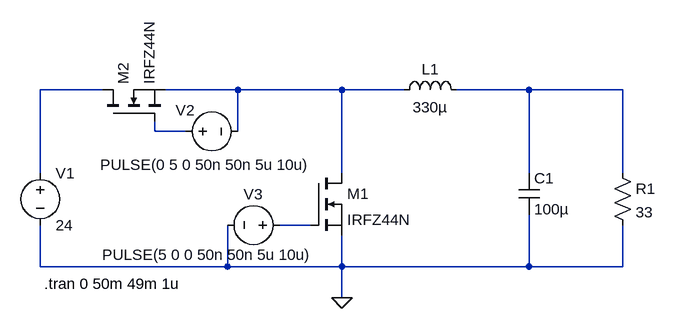
[diagram p0: schematic Lab2_LTSpice.asc]
Lab2_LTSpice.asc, the LTspice schematic file:
Version 4
SHEET 1 880 740
WIRE -16 400 -112 400
WIRE 192 400 80 400
WIRE 352 400 192 400
WIRE 448 400 352 400
WIRE 640 400 528 400
WIRE 784 400 640 400
WIRE 64 464 64 448
WIRE 112 464 64 464
WIRE 192 464 192 400
WIRE -112 528 -112 400
WIRE 352 528 352 400
WIRE 640 528 640 400
WIRE 784 528 784 400
WIRE 304 608 256 608
WIRE -112 672 -112 608
WIRE 176 672 176 608
WIRE 176 672 -112 672
WIRE 352 672 352 624
WIRE 352 672 176 672
WIRE 640 672 640 592
WIRE 640 672 352 672
WIRE 784 672 784 608
WIRE 784 672 640 672
WIRE 352 720 352 672
FLAG 352 720 0
SYMBOL voltage -112 512 R0
WINDOW 123 0 0 Left 0
WINDOW 39 0 0 Left 0
SYMATTR InstName V1
SYMATTR Value 24
SYMBOL nmos 304 528 R0
SYMATTR InstName M1
SYMATTR Value IRFZ44N
SYMBOL nmos -16 448 R270
SYMATTR InstName M2
SYMATTR Value IRFZ44N
SYMBOL ind 432 416 R270
WINDOW 0 32 56 VTop 2
WINDOW 3 5 56 VBottom 2
SYMATTR InstName L1
SYMATTR Value 330µ
SYMBOL cap 624 528 R0
SYMATTR InstName C1
SYMATTR Value 100µ
SYMBOL res 768 512 R0
SYMATTR InstName R1
SYMATTR Value 33
SYMBOL voltage 96 464 R270
WINDOW 0 33 0 VRight 2
WINDOW 3 -51 -116 VRight 2
WINDOW 123 0 0 Left 0
WINDOW 39 0 0 Left 0
SYMATTR InstName V2
SYMATTR Value PULSE(0 5 0 50n 50n 5u 10u)
SYMBOL voltage 272 608 R90
WINDOW 0 -32 56 VBottom 2
WINDOW 3 30 127 VTop 2
WINDOW 123 0 0 Left 0
WINDOW 39 0 0 Left 0
SYMATTR InstName V3
SYMATTR Value PULSE(5 0 0 50n 50n 5u 10u)
TEXT -106 698 Left 2 !.tran 0 50m 49m 1u

The netlist it stands for:
* Lab2_LTSpice.asc
V1 N001 0 24
M1 N002 N005 0 0 IRFZ44N
M2 N001 N004 N002 N002 IRFZ44N
L1 N002 N003 330µ
C1 N003 0 100µ
R1 N003 0 33
V2 N004 N002 PULSE(0 5 0 50n 50n 5u 10u)
V3 N005 0 PULSE(5 0 0 50n 50n 5u 10u)
.model NMOS NMOS
.model PMOS PMOS
.lib standard.mos
.tran 0 50m 49m 1u
.backanno
.end